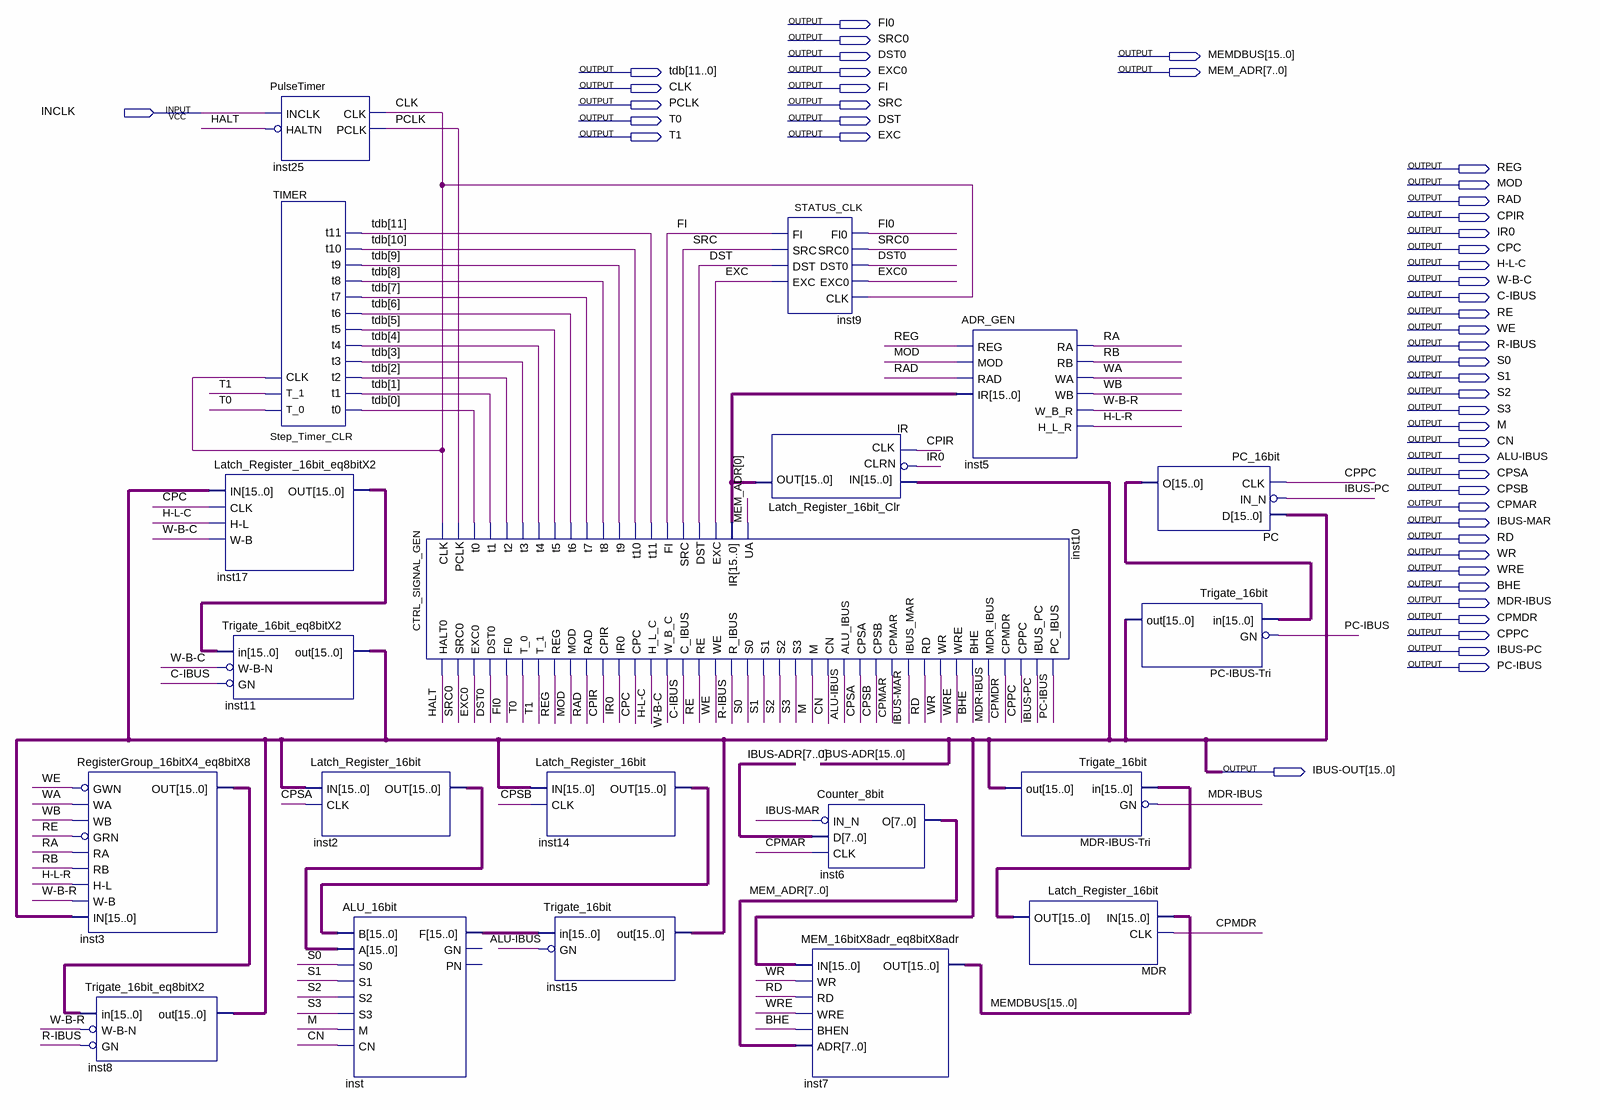
[diagram p0: schematic sheet]
// Quartus schematic CPU_Prototype_MKII.bdf as structural Verilog: 20 symbols, 49 pins
module CPU_Prototype_MKII (
  input  INCLK,
  output FI0,
  output SRC0,
  output DST0,
  output [15:0] MEMDBUS,
  output [11:0] tdb,
  output EXC0,
  output [7:0] MEM_ADR,
  output CLK,
  output FI,
  output PCLK,
  output SRC,
  output T0,
  output DST,
  output T1,
  output EXC,
  output REG,
  output MOD,
  output RAD,
  output CPIR,
  output IR0,
  output CPC,
  output \H-L-C ,
  output \W-B-C ,
  output \C-IBUS ,
  output RE,
  output WE,
  output \R-IBUS ,
  output S0,
  output S1,
  output S2,
  output S3,
  output M,
  output CN,
  output \ALU-IBUS ,
  output CPSA,
  output CPSB,
  output CPMAR,
  output \IBUS-MAR ,
  output RD,
  output WR,
  output WRE,
  output BHE,
  output \MDR-IBUS ,
  output CPMDR,
  output CPPC,
  output \IBUS-PC ,
  output \PC-IBUS ,
  output [15:0] \IBUS-OUT 
);

  wire \H-L-R , HALT, RA, RB, \W-B-R , WA, WB;
  wire [15:0] inst2_out, inst3_out, inst14_out, inst17_out, inst_f, IR_out, MDR_out, PC_o;

  RegisterGroup_16bitX4_eq8bitX8 inst3 (
    .GWN(~WE), .WA(WA), .WB(WB), .GRN(~RE), .RA(RA), .RB(RB), .\H-L (\H-L-R ), .\W-B (\W-B-R ),
    .IN(\IBUS-OUT ), .OUT(inst3_out));
  Trigate_16bit_eq8bitX2 inst8 (.in(inst3_out), .\W-B-N (~\W-B-R ), .GN(~\R-IBUS ), .out(\IBUS-OUT ));
  Latch_Register_16bit_eq8bitX2 inst17 (.IN(\IBUS-OUT ), .CLK(CPC), .\H-L (\H-L-C ), .\W-B (\W-B-C ), .OUT(inst17_out));
  Trigate_16bit_eq8bitX2 inst11 (.in(inst17_out), .\W-B-N (~\W-B-C ), .GN(~\C-IBUS ), .out(\IBUS-OUT ));
  PulseTimer inst25 (.INCLK(INCLK), .HALTN(~HALT), .CLK(CLK), .PCLK(PCLK));
  Step_Timer_CLR TIMER (
    .T_0(T0), .T_1(T1), .CLK(CLK), .t0(tdb[0]), .t1(tdb[1]), .t2(tdb[2]), .t3(tdb[3]), .t4(tdb[4]),
    .t5(tdb[5]), .t6(tdb[6]), .t7(tdb[7]), .t8(tdb[8]), .t9(tdb[9]), .t10(tdb[10]), .t11(tdb[11]));
  Latch_Register_16bit inst2 (.IN(\IBUS-OUT ), .CLK(CPSA), .OUT(inst2_out));
  ALU_16bit inst (
    .B(inst14_out), .A(inst2_out), .S0(S0), .S1(S1), .S2(S2), .S3(S3), .M(M), .CN(CN), .F(inst_f));  // open: GN, PN
  CTRL_SIGNAL_GEN inst10 (
    .CLK(CLK), .PCLK(PCLK), .t0(tdb[0]), .t1(tdb[1]), .t2(tdb[2]), .t3(tdb[3]), .t4(tdb[4]), .t5(tdb[5]),
    .t6(tdb[6]), .t7(tdb[7]), .t8(tdb[8]), .t9(tdb[9]), .t10(tdb[10]), .t11(tdb[11]), .FI(FI), .SRC(SRC),
    .DST(DST), .EXC(EXC), .IR(IR_out), .UA(MEM_ADR[0]), .HALT0(HALT), .SRC0(SRC0), .EXC0(EXC0), .DST0(DST0),
    .FI0(FI0), .T_0(T0), .T_1(T1), .REG(REG), .MOD(MOD), .RAD(RAD), .CPIR(CPIR), .IR0(IR0), .CPC(CPC),
    .H_L_C(\H-L-C ), .W_B_C(\W-B-C ), .C_IBUS(\C-IBUS ), .RE(RE), .WE(WE), .R_IBUS(\R-IBUS ), .S0(S0),
    .S1(S1), .S2(S2), .S3(S3), .M(M), .CN(CN), .ALU_IBUS(\ALU-IBUS ), .CPSA(CPSA), .CPSB(CPSB),
    .CPMAR(CPMAR), .IBUS_MAR(\IBUS-MAR ), .RD(RD), .WR(WR), .WRE(WRE), .BHE(BHE), .MDR_IBUS(\MDR-IBUS ),
    .CPMDR(CPMDR), .CPPC(CPPC), .IBUS_PC(\IBUS-PC ), .PC_IBUS(\PC-IBUS ));
  Latch_Register_16bit inst14 (.IN(\IBUS-OUT ), .CLK(CPSB), .OUT(inst14_out));
  Trigate_16bit inst15 (.in(inst_f), .GN(~\ALU-IBUS ), .out(\IBUS-OUT ));
  STATUS_CLK inst9 (
    .FI0(FI0), .SRC0(SRC0), .DST0(DST0), .EXC0(EXC0), .CLK(CLK), .FI(FI), .SRC(SRC), .DST(DST), .EXC(EXC));
  Latch_Register_16bit_Clr IR (.IN(\IBUS-OUT ), .CLRN(~IR0), .CLK(CPIR), .OUT(IR_out));
  MEM_16bitX8adr_eq8bitX8adr inst7 (
    .IN(\IBUS-OUT ), .WR(WR), .RD(RD), .WRE(WRE), .BHEN(BHE), .ADR(MEM_ADR), .OUT(MEMDBUS));
  Counter_8bit inst6 (.IN_N(~\IBUS-MAR ), .D(\IBUS-OUT [7:0]), .CLK(CPMAR), .O(MEM_ADR));
  ADR_GEN inst5 (
    .REG(REG), .MOD(MOD), .RAD(RAD), .IR(IR_out), .RA(RA), .RB(RB), .WA(WA), .WB(WB), .W_B_R(\W-B-R ),
    .H_L_R(\H-L-R ));
  Trigate_16bit \MDR-IBUS-Tri  (.in(MDR_out), .GN(~\MDR-IBUS ), .out(\IBUS-OUT ));
  Latch_Register_16bit MDR (.IN(MEMDBUS), .CLK(CPMDR), .OUT(MDR_out));
  PC_16bit PC (.CLK(CPPC), .IN_N(~\IBUS-PC ), .D(\IBUS-OUT ), .O(PC_o));
  Trigate_16bit \PC-IBUS-Tri  (.in(PC_o), .GN(~\PC-IBUS ), .out(\IBUS-OUT ));

  // Other names for the same wires on the sheet: IBUS-ADR[15:0] = \IBUS-OUT 
endmodule
